# EAGLE design pcb2 (EAGLE 9.5.1)
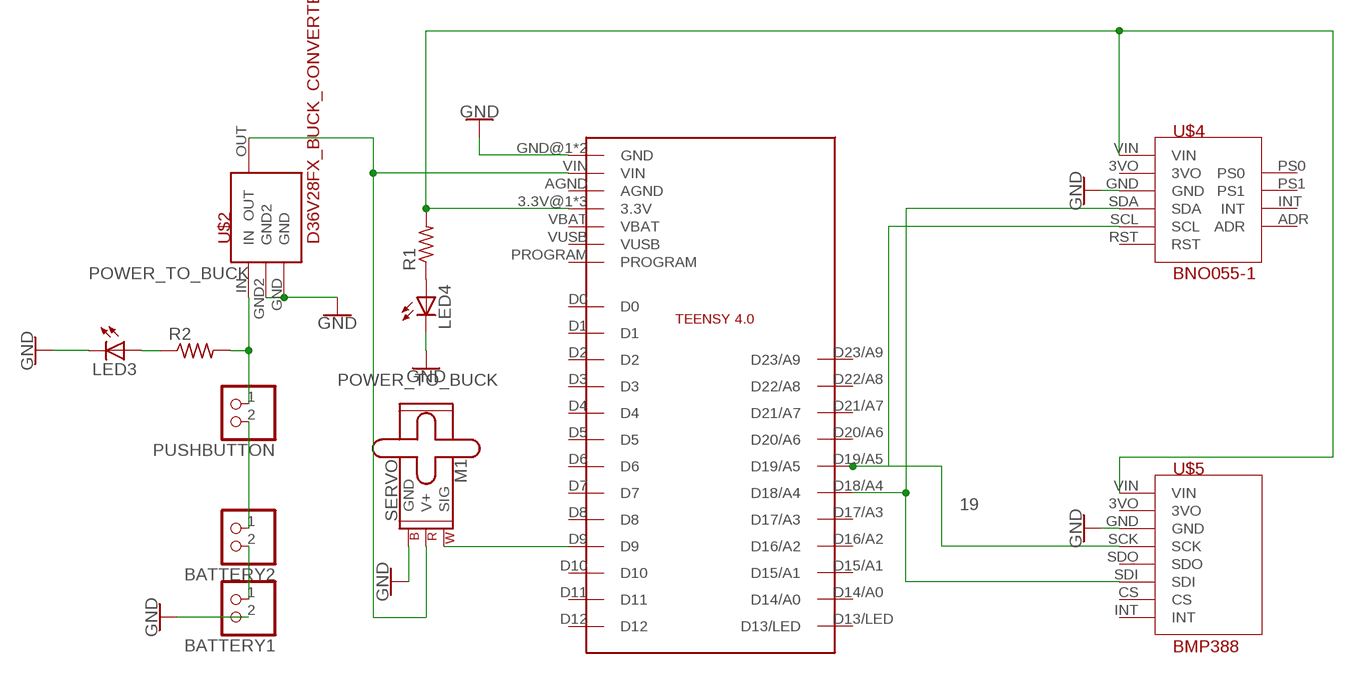
[diagram p0: schematic, sheet 1]

## Parts
BATTERY1  JST_2PIN-THM  [JST-PH-2-THM]
BATTERY2  JST_2PIN-THM  [JST-PH-2-THM]
LED3  LED5MM  [LED5MM]
LED4  LED5MM  [LED5MM]
M1  SERVO  [1X03]
PUSHBUTTON  JST_2PIN-THM-RA  [JST-PH-2-THM-RA]
R1  R-US_0207/12  [0207/12]
R2  R-US_0207/12  [0207/12]
U$1  TEENSY4.0  [TEENSY4.0]
U$2  D36V28FX_BUCK_CONVERTER  [D36V28FX_BUCK_CONVERTER]
U$4  BNO055-1  [BNO055]
U$5  BMP388  [BMP388]

## Nets
19: U$1.D19/A5 U$4.SCL U$5.SCK
GND: BATTERY1.2 LED3.K(C) LED4.K(C) M1.3(GND) U$1.GND@1(GND) U$1.GND@2(GND) U$2.GND U$2.GND2 U$4.GND U$5.GND
N$1: M1.1(SIG) U$1.D9
N$2: U$1.D18/A4 U$4.SDA U$5.SDI
N$3: LED3.A R2.1
N$4: R1.2 U$1.3.3V@1(3.3V) U$1.3.3V@2(3.3V) U$1.ON/OFF(3.3V) U$4.VIN U$5.VIN
N$5: BATTERY2.1 PUSHBUTTON.2
N$6: LED4.A R1.1
N$7: BATTERY1.1 BATTERY2.2
OUT: M1.2(V+) U$1.VIN U$2.OUT
POWER_TO_BUCK: PUSHBUTTON.1 R2.2 U$2.IN
Unconnected: U$1.AGND U$1.D0 U$1.D1 U$1.D2 U$1.D3 U$1.D4 U$1.D5 U$1.D6 U$1.D7 U$1.D8 U$1.D10 U$1.D11 U$1.D12 U$1.D13/LED U$1.D14/A0 U$1.D15/A1 U$1.D16/A2 U$1.D17/A3 U$1.D20/A6 U$1.D21/A7 U$1.D22/A8 U$1.D23/A9 U$1.PROGRAM U$1.VBAT U$1.VUSB U$4.3VO U$4.ADR U$4.INT U$4.PS0 U$4.PS1 U$4.RST U$5.3VO U$5.CS U$5.INT U$5.SDO

## Library data of the parts
BATTERY1 BATTERY2 PUSHBUTTON = adafruit:JST_2PIN: JST 2-Pin Connectors of various flavors SMT-RA (S2B-PH-SM4) 4UConnector #17311 SMT (B2B-PH-SM4) THM-RA (S2B-PH) THM (B2B-PH)
LED3 LED4 = adafruit:LED: LED OSRAM: - CHIPLED LG R971, LG N971, LY N971, LG Q971, LY Q971, LO R971, LY R971 LH N974, LH R974 LS Q976, LO Q976, LY Q976 LO Q996 - Hyper CHIPLED LW Q18S LB Q993, LB Q99A, LB R99A - SideLED LS A670, LO A670, LY A670, LG A670, LP A670 LB A673, LV A673, LT A673, LW A673 LH A674 LY A675 LS A676, LA A676, LO A676, LY A676, LW A676 LS A679, LY A679, LG A679 - Hyper Micro SIDELED® LS Y876, LA Y876, LO Y876, LY Y876 LT Y87S - SmartLED LW L88C, LW L88S LB L89C, LB L89S, LG L890 LS L89K, LO L89K, LY L89K LS L896, LA L896, LO L896, LY L896 - TOPLED LS T670, LO T670, LY T670, LG T670, LP T670 LSG T670, LSP T670, LSY T670, LOP T670, LYG T670 LG T671, LOG T671, LSG T671 LB T673, LV T673, LT T673, LW T673 LH T674 LS T676, LA T676, LO T676, LY T676, LB T676, LH T676, LSB T676, LW T676 LB T67C, LV T67C, LT T67C, LS T67K, LO T67K, LY T67K, LW E67C LS E67B, LA E67B, LO E67B, LY E67B, LB E67C, LV E67C, LT E67C LW T67C LS T679, LY T679, LG T679 LS T770, LO T770, LY T770, LG T770, LP T770 LB T773, LV T773, LT T773, LW T773 LH T774 LS E675, LA E675, LY E675, LS T675 LS T776, LA T776, LO T776, LY T776, LB T776 LHGB T686 LT T68C, LB T68C - Hyper Mini TOPLED® LB M676 - Mini TOPLED Santana® LG M470 LS M47K, LO M47K, LY M47K Source: http://www.osram.convergy.de/
M1 = SparkFun-Electromechanical:SERVO: Servo Motor 3-pin connector for a standard servo motor (voltage supply, ground, and control signal.) SparkFun Products Servo - Generic (Sub-Micro Size) <https://www.sparkfun.com/products/9065> (ROB-09065) Servo - Generic High Torque Continuous Rotation (Standard Size) <https://www.sparkfun.com/products/9347> (ROB-09347) Servo - Generic High Torque (Standard Size) <https://www.sparkfun.com/products/11965> (ROB-11965)
R1 R2 = adafruit:R-US_: RESISTOR, American symbol
U$1 = Teensy4.0:TEENSY4.0
U$2 = ADS:D36V28FX_BUCK_CONVERTER
U$4 = ADS:BNO055-1
U$5 = ADS:BMP388

## Board
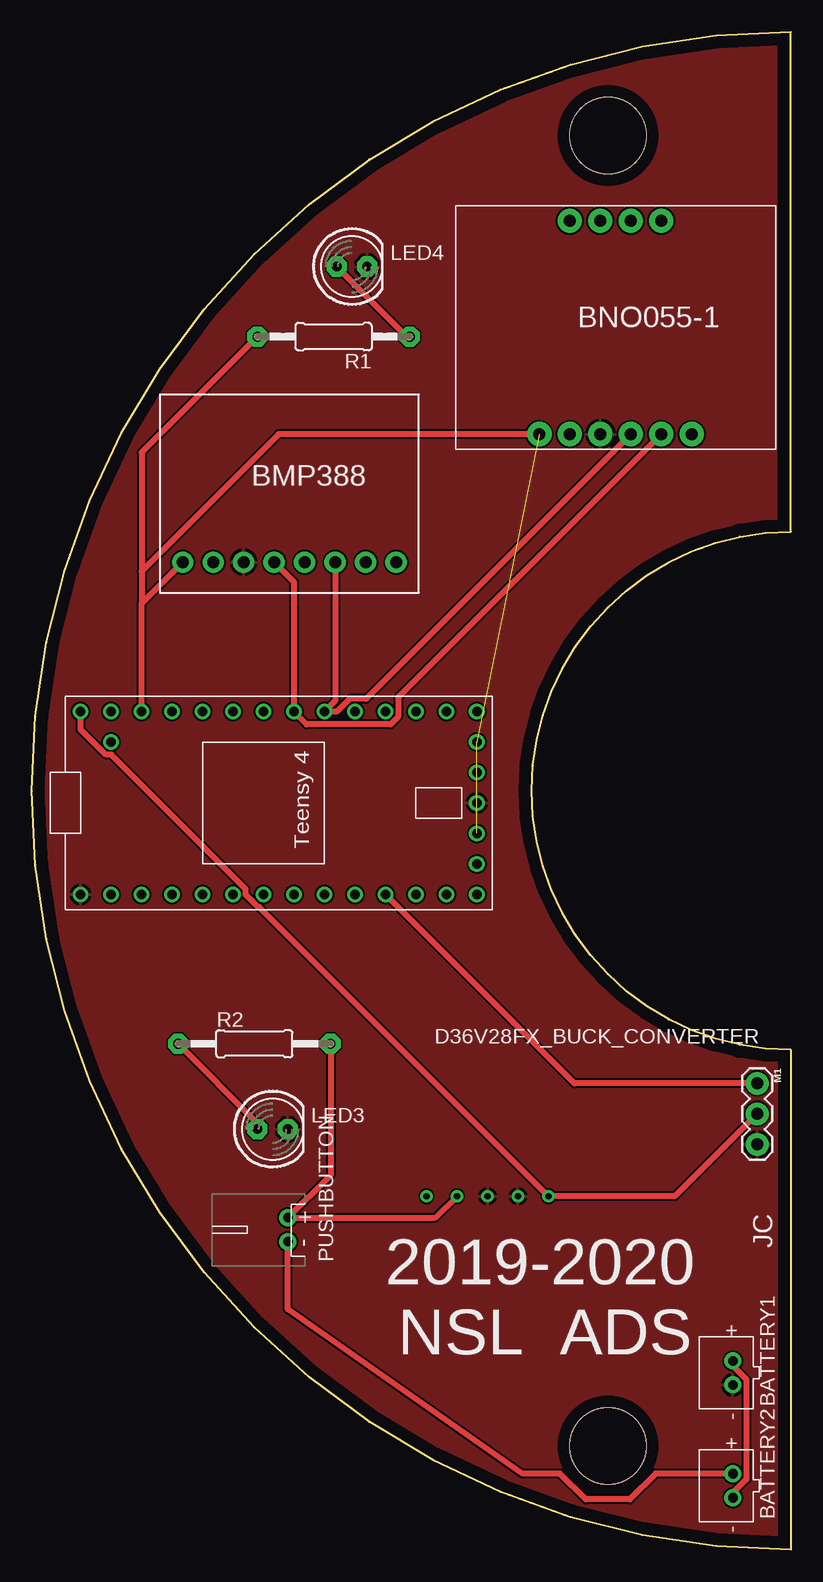
[diagram p1: board, top side]
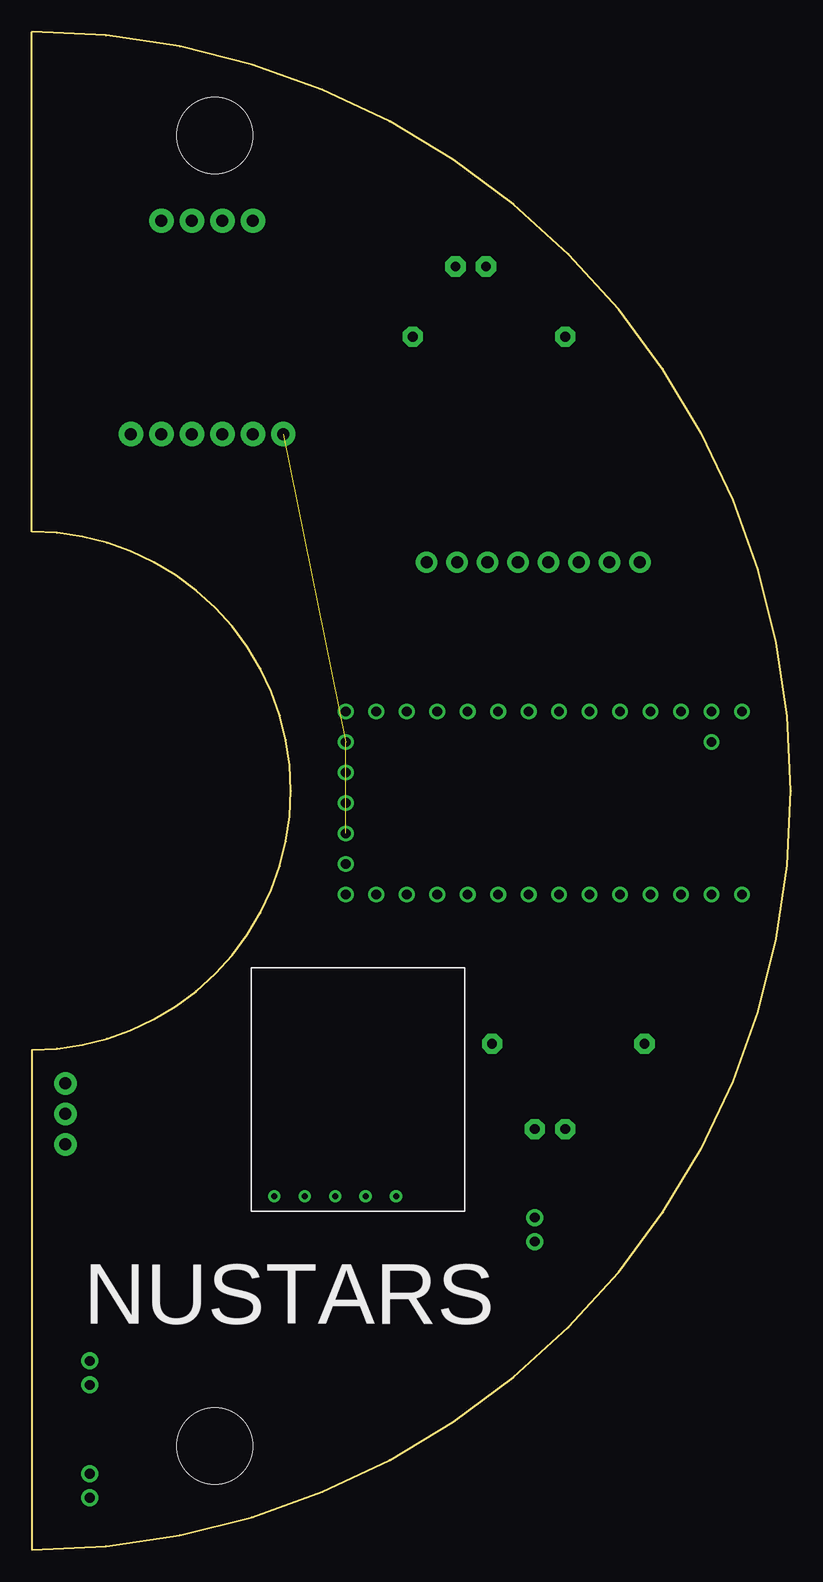
[diagram p2: board, bottom side, seen from below]

Size 63.25 x 126.49 mm. Coordinates in mm from the lower left corner, seen from the top.
Outline: 63.25,41.66 arc-180 63.25,84.84 63.25,126.49 arc180 63.25,0 63.25,41.66
Copper layers (1*16): Top 0.035mm / dielectric 1.5mm / Bottom 0.035mm
Design rules "default": minimum track width 6mil, minimum drill 0.35mm, track to track 6mil, track to pad 6mil, pad to pad 6mil, via to via 6mil, smd to smd 6mil, copper to edge 40mil, drill to drill 6mil, minimum pad ring 10mil, minimum via ring 8mil, stop-mask expansion 4mil, vias tented up to drill 0mil, thermal gap 10mil
Holes 6.35 mm at 48.01,8.64 48.01,117.86

### Footprints (pad centres in the part's own frame; a part is rotated, then mirrored left to right if it is on the bottom)
JST-PH-2-THM = drill 0.8 pad 1.422: 1 1,0; 2 -1,0
LED5MM = drill 0.813 pad 1.676 octagon: A -1.27,0; K 1.27,0
1X03 = drill 1.016 pad 1.88: 1 0,0; 2 2.54,0; 3 5.08,0
JST-PH-2-THM-RA = drill 0.8 pad 1.422: 1 1,0; 2 -1,0
0207/12 = drill 0.813 pad 1.676 octagon: 1 -6.35,0; 2 6.35,0
TEENSY4.0 = drill 0.8: 3.3V@1 7.62,10.16; 3.3V@2 -2.54,-17.78; AGND 7.62,12.7; D0 -7.62,12.7; D1 -7.62,10.16; D2 -7.62,7.62; D3 -7.62,5.08; D4 -7.62,2.54; D5 -7.62,0; D6 -7.62,-2.54; D7 -7.62,-5.08; D8 -7.62,-7.62; D9 -7.62,-10.16; D10 -7.62,-12.7; D11 -7.62,-15.24; D12 -7.62,-17.78; D13/LED 7.62,-17.78; D14/A0 7.62,-15.24; D15/A1 7.62,-12.7; D16/A2 7.62,-10.16; D17/A3 7.62,-7.62; D18/A4 7.62,-5.08; D19/A5 7.62,-2.54; D20/A6 7.62,0; D21/A7 7.62,2.54; D22/A8 7.62,5.08; D23/A9 7.62,7.62; GND@1 -7.62,15.24; GND@2 0,-17.78; ON/OFF 5.08,-17.78; PROGRAM 2.54,-17.78; VBAT -5.08,-17.78; VIN 7.62,15.24; VUSB 5.08,12.7
D36V28FX_BUCK_CONVERTER = drill 0.508 pad 1.016: EN 5.715,1.27; GND 13.335,1.27; GND2 10.795,1.27; IN 8.255,1.27; OUT 15.875,1.27
BNO055 = drill 1.016 pad 2.032: 3VO 9.525,1.27; ADR 17.145,19.05; GND 12.065,1.27; INT 14.605,19.05; PS0 9.525,19.05; PS1 12.065,19.05; RST 19.685,1.27; SCL 17.145,1.27; SDA 14.605,1.27; VIN 6.985,1.27
BMP388 = drill 1.003 pad 1.778: 3VO 4.445,2.54; CS 17.145,2.54; GND 6.985,2.54; INT 19.685,2.54; SCK 9.525,2.54; SDI 14.605,2.54; SDO 12.065,2.54; VIN 1.905,2.54

### Placement (x,y rotation side)
BATTERY1  58.42,14.73 90 top
BATTERY2  58.42,5.33 90 top
LED3  20.07,35.05 0 top
LED4  26.67,106.93 0 top
M1  60.45,38.86 270 top
PUSHBUTTON  21.34,26.67 90 top
R1  25.15,101.09 180 top
R2  18.54,42.16 0 top
U$1  19.3,62.23 90 top
U$2  27.18,28.19 0 top
U$4  35.31,91.69 0 top
U$5  10.67,79.76 0 top

### Tracks (layer width: path | path; a pad name or v marks a point on that pad's centre or on a via)
19
  Top 0.508: U$5.SCK 21.84,80.64 U$1.D19/A5 22.9,68.79 29.9,68.79 30.52,69.41 30.52,71.04 U$4.SCL
GND
  Top 0.152: 63.25,41.66 arc-180 63.25,84.84 63.25,126.49 arc180 63.25,0 63.25,41.66
  pour Top: 63.25,41.66 63.25,0 arc-180 63.25,126.49 63.25,84.84 arc180
N$1
  Top 0.152: 29.72,54.36 U$1.D9
  Top 0.508: M1.1 45.21,38.86 29.72,54.36
N$2
  Top 0.152: U$4.SDA 41.27,84.33
  Top 0.508: U$5.SDI 25.27,70.74 U$1.D18/A4 25.42,69.85 26.48,70.91 27.86,70.91 U$4.SDA
N$3
  Top 0.508: R2.1 18.8,35.56 LED3.A
N$4  (2 unrouted)
  Top 0.508: U$1.3.3V@1 9.14,78.87 | 9.14,78.87 U$5.VIN | U$4.VIN 20.57,92.96 9.14,81.53 | 9.14,81.53 9.14,78.87 | R1.2 9.14,91.44 9.14,81.53
N$5
  Top 0.508: BATTERY2.1 51.99,6.33 49.85,4.19 46.16,4.19 44.01,6.35 40.87,6.35 21.34,20.03 PUSHBUTTON.2
N$6
  Top 0.508: R1.1 31.24,101.09 LED4.A
N$7
  Top 0.508: BATTERY1.1 58.42,15.31 59.54,14.2 59.54,5.87 58.42,4.75 BATTERY2.2
OUT
  Top 0.508: U$1.VIN 4.06,68.35 6.16,66.25 6.62,66.25 17.82,55.05 17.82,54.59 18.86,53.55 18.97,53.55 U$2.OUT 53.59,29.46 M1.2
POWER_TO_BUCK
  Top 0.508: R2.2 24.89,31.23 PUSHBUTTON.1 33.64,27.67 U$2.IN

### Text on the board
tPlace: JC | 2019-2020 | NSL ADS
bPlace: NUSTARS